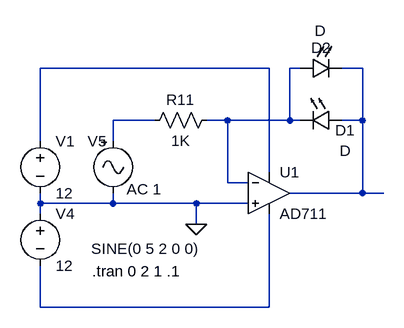
[diagram p0: schematic newmon.asc]
newmon.asc, the LTspice schematic file:
Version 4
SHEET 1 1412 736
WIRE 336 176 -16 176
WIRE 384 176 368 176
WIRE 480 176 448 176
WIRE 160 256 96 256
WIRE 272 256 240 256
WIRE 368 256 368 176
WIRE 368 256 272 256
WIRE 384 256 368 256
WIRE 480 256 480 176
WIRE 480 256 448 256
WIRE -16 288 -16 176
WIRE 96 288 96 256
WIRE 336 336 336 176
WIRE 272 352 272 256
WIRE 304 352 272 352
WIRE 480 368 480 256
WIRE 480 368 368 368
WIRE 512 368 480 368
WIRE -16 384 -16 368
WIRE 96 384 96 368
WIRE 96 384 -16 384
WIRE 224 384 96 384
WIRE 304 384 224 384
WIRE -16 400 -16 384
WIRE 224 416 224 384
WIRE -16 544 -16 480
WIRE 336 544 336 400
WIRE 336 544 -16 544
FLAG 224 416 0
SYMBOL voltage -16 272 R0
WINDOW 123 0 0 Left 0
WINDOW 39 0 0 Left 0
SYMATTR InstName V1
SYMATTR Value 12
SYMBOL voltage -16 384 R0
WINDOW 123 0 0 Left 0
WINDOW 39 0 0 Left 0
SYMATTR InstName V4
SYMATTR Value 12
SYMBOL res 256 240 R90
WINDOW 0 0 56 VBottom 2
WINDOW 3 32 56 VTop 2
SYMATTR InstName R11
SYMATTR Value 1K
SYMBOL Misc\\signal 96 272 R0
WINDOW 123 21 90 Left 2
WINDOW 39 0 0 Left 0
WINDOW 3 -34 182 Left 2
WINDOW 0 -39 16 Left 2
SYMATTR Value2 AC 1
SYMATTR Value SINE(0 5 2 0 0)
SYMATTR InstName V5
SYMBOL Opamps\\AD711 336 304 R0
SYMATTR InstName U1
SYMBOL LED 448 240 R90
WINDOW 0 47 -5 VBottom 2
WINDOW 3 47 -5 VTop 2
SYMATTR InstName D1
SYMBOL LED 384 160 M90
WINDOW 0 0 32 VBottom 2
WINDOW 3 -57 31 VTop 2
SYMATTR InstName D2
TEXT 64 488 Left 2 !.tran 0 2 1 .1

The netlist it stands for:
* newmon.asc
V1 N001 0 12
V4 0 N005 12
R11 N002 N004 1K
V5 N004 0 SINE(0 5 2 0 0) AC 1
XU1 0 N002 N001 N005 N003 AD712  ; AD711, pins In+ In- V+ V- OUT
D1 N003 N002 D
D2 N002 N003 D
.model D D
.lib standard.dio
.tran 0 2 1 .1
.lib ADI1.lib
.backanno
.end